# EAGLE schematic Schematic_v7 (EAGLE 9.7.0)
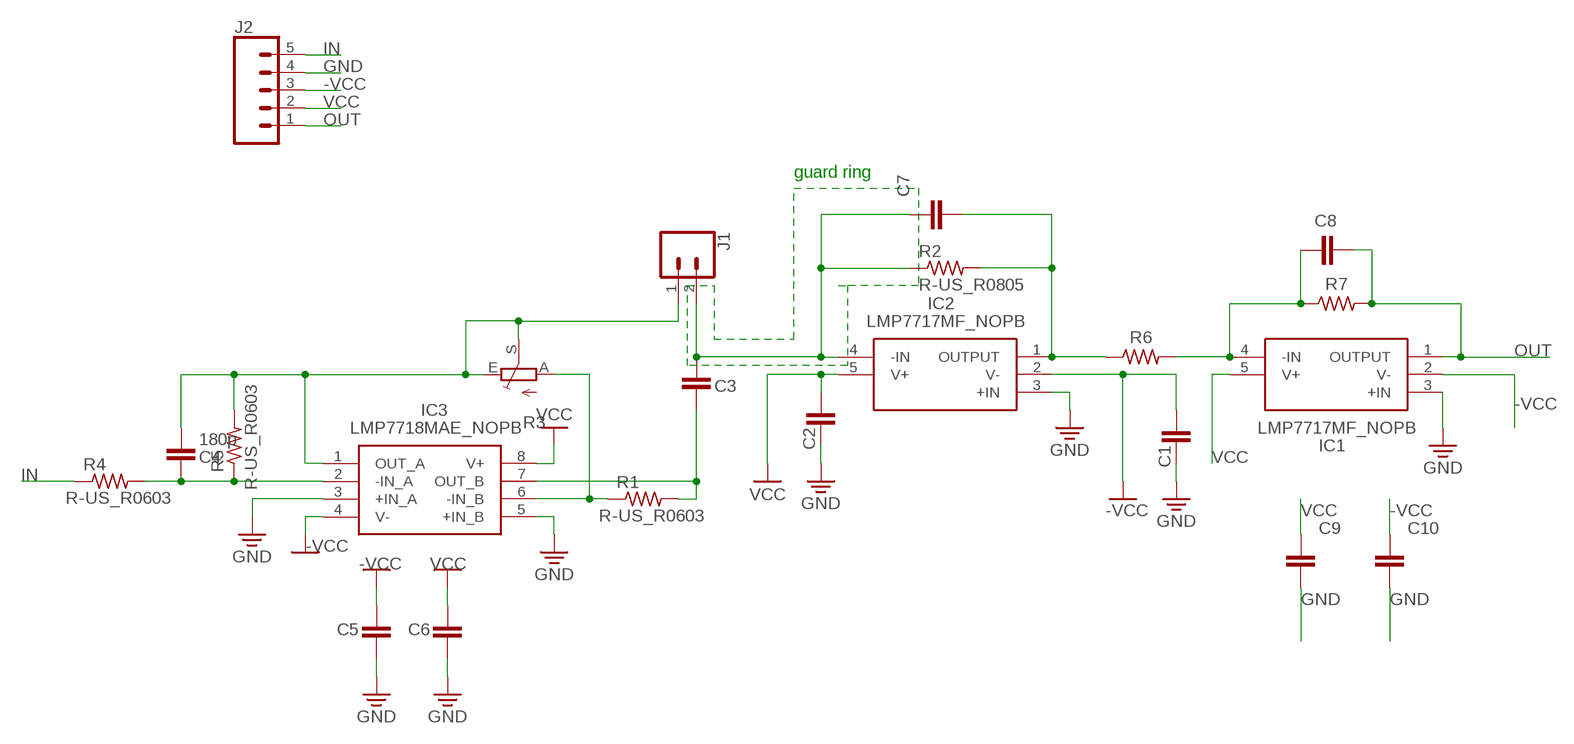
[diagram p0: schematic, sheet 1]

## Parts
C1  C_CHIP-0603(1608-METRIC)  [CAPC1608X85]
C2  C_CHIP-0603(1608-METRIC)  [CAPC1608X85]
C3  C_CHIP-0805(2012-METRIC)  [CAPC2012X110]
C4  180p  C_CHIP-0805(2012-METRIC)  [CAPC2012X110]
C5  C_CHIP-0805(2012-METRIC)  [CAPC2012X110]
C6  C_CHIP-0805(2012-METRIC)  [CAPC2012X110]
C7  C_CHIP-0805(2012-METRIC)  [CAPC2012X110]
C8  C_CHIP-0805(2012-METRIC)  [CAPC2012X110]
C9  C_CHIP-0603(1608-METRIC)  [CAPC1608X85]
C10  C_CHIP-0603(1608-METRIC)  [CAPC1608X85]
IC1  LMP7717MF_NOPB  [SOT95P280X145-5N]
IC2  LMP7717MF_NOPB  [SOT95P280X145-5N]
IC3  LMP7718MAE_NOPB  [SOIC127P600X175-8N]
J1  CONN_02LOCK  [1X02_LOCK]
J2  CONN_05  [1X05]
R1  R-US_R0603  [R0603]
R2  R-US_R0805  [R0805]
R3  TRIM_EU-RJ9W  [RJ9W]
R4  R-US_R0603  [R0603]
R5  R-US_R0603  [R0603]
R6  R-US_CHIP-0603(1608-METRIC)  [RESC1608X60]
R7  R-US_CHIP-0603(1608-METRIC)  [RESC1608X60]

## Nets
-VCC: C1.2 C5.2 C10.1 IC1.2(V-) IC2.2(V-) IC3.4(V-) J2.3 ; supply symbol labelled VCC
GND [New Class]: C1.1 C2.1 C5.1 C6.1 C9.2 C10.2 IC1.3(+IN) IC2.3(+IN) IC3.3(+IN_A) IC3.5(+IN_B) J2.4
IN: J2.5 R4.1
N$1: C7.2 IC2.1(OUTPUT) R2.2 R6.1
N$2: C3.1 C7.1 IC2.4(-IN) J1.2 R2.1
N$3: C4.1 IC3.1(OUT_A) J1.1 R3.E R3.S R5.2
N$4: C3.2 IC3.7(OUT_B) R1.2
N$5: IC3.6(-IN_B) R1.1 R3.A
N$6: C4.2 IC3.2(-IN_A) R4.2 R5.1
N$7: C8.1 IC1.4(-IN) R6.2 R7.1
OUT: C8.2 IC1.1(OUTPUT) J2.1 R7.2
VCC: C2.2 C6.2 C9.1 IC1.5(V+) IC2.5(V+) IC3.8(V+) J2.2

## Notes on the sheet
- guard ring

## Library data of the parts
C1-C10 = Capacitor:C: Capacitor - Generic; CATEGORY: Capacitor
IC1 IC2 = SamacSys_Parts:LMP7717MF_NOPB: Single Channel, 88 MHz, Precision, Low Noise, 1.8V CMOS Input, Decompensated Amplifier Source: Datasheet <http://www.ti.com/lit/ds/symlink/lmp7717.pdf>; DESCRIPTION: Single Channel, 88 MHz, Precision, Low Noise, 1.8V CMOS Input, Decompensated Amplifier; HEIGHT: 1.45mm; MANUFACTURER_NAME: Texas Instruments; MANUFACTURER_PART_NUMBER: LMP7717MF/NOPB; MOUSER_PART_NUMBER: 926-LMP7717MF/NOPB; MOUSER_PRICE-STOCK: https://www.mouser.com/Search/Refine.aspx?Keyword=926-LMP7717MF%2FNOPB; RS_PART_NUMBER: 0408704P; RS_PRICE-STOCK: http://uk.rs-online.com/web/p/products/0408704P
IC3 = SamacSys_Parts:LMP7718MAE_NOPB: Operational Amplifiers - Op Amps 88 MHz, Precision, Low Noise, 1.8V CMOS Input, Decompensated Operational Amplifier 8-SOIC -40 to 125 Source: Datasheet <http://www.ti.com/lit/ds/symlink/lmp7718.pdf>; DESCRIPTION: Operational Amplifiers - Op Amps 88 MHz, Precision, Low Noise, 1.8V CMOS Input, Decompensated Operational Amplifier 8-SOIC -40 to 125; HEIGHT: 1.75mm; MANUFACTURER_NAME: Texas Instruments; MANUFACTURER_PART_NUMBER: LMP7718MAE/NOPB; MOUSER_PART_NUMBER: 926-LMP7718MAE/NOPB; MOUSER_PRICE-STOCK: https://www.mouser.com/Search/Refine.aspx?Keyword=926-LMP7718MAE%2FNOPB
J1 = SparkFun-Connectors:CONN_02: Multi connection point. Often used as Generic Header-pin footprint for 0.1 inch spaced/style header connections On any of the 0.1 inch spaced packages, you can populate with these: Break Away Headers - Straight <https://www.sparkfun.com/products/116> (PRT-00116) Break Away Male Headers - Right Angle <https://www.sparkfun.com/products/553> (PRT-00553) Female Headers <https://www.sparkfun.com/products/115> (PRT-00115) Break Away Headers - Machine Pin <https://www.sparkfun.com/products/117> (PRT-00117) Break Away Female Headers - Swiss Machine Pin <https://www.sparkfun.com/products/743> (PRT-00743) For SCREWTERMINALS and SPRING TERMINALS visit here: Screw Terimnals on SparkFun.com <https://www.sparkfun.com/search/results?term=Screw+Terminals> (5mm/3.5mm/2.54mm spacing) This device is also useful as a general connection point to wire up your design to another part of your project. Our various solder wires solder well into these plated through hole pads. Hook-Up Wire - Assortment (Stranded, 22 AWG) <https://www.sparkfun.com/products/11375> (PRT-11375) Hook-Up Wire - Assortment (Solid Core, 22 AWG) <https://www.sparkfun.com/products/11367> (PRT-11367) View the entire wire category on our website here <https://www.sparkfun.com/categories/141> Special notes: Molex polarized connector foot print use with: PRT-08233 with associated crimp pins and housings. 2.54_SCREWTERM for use with PRT-10571. 3.5mm Screw Terminal footprints for PRT-08084 5mm Screw Terminal footprints for use with PRT-08432
J2 = SparkFun-Connectors:CONN_05: Multi connection point. Often used as Generic Header-pin footprint for 0.1 inch spaced/style header connections On any of the 0.1 inch spaced packages, you can populate with these: Break Away Headers - Straight <https://www.sparkfun.com/products/116> (PRT-00116) Break Away Male Headers - Right Angle <https://www.sparkfun.com/products/553> (PRT-00553) Female Headers <https://www.sparkfun.com/products/115> (PRT-00115) Break Away Headers - Machine Pin <https://www.sparkfun.com/products/117> (PRT-00117) Break Away Female Headers - Swiss Machine Pin <https://www.sparkfun.com/products/743> (PRT-00743) For SCREWTERMINALS and SPRING TERMINALS visit here: Screw Terimnals on SparkFun.com <https://www.sparkfun.com/search/results?term=Screw+Terminals> (5mm/3.5mm/2.54mm spacing) This device is also useful as a general connection point to wire up your design to another part of your project. Our various solder wires solder well into these plated through hole pads. Hook-Up Wire - Assortment (Stranded, 22 AWG) <https://www.sparkfun.com/products/11375> (PRT-11375) Hook-Up Wire - Assortment (Solid Core, 22 AWG) <https://www.sparkfun.com/products/11367> (PRT-11367) View the entire wire category on our website here <https://www.sparkfun.com/categories/141> Special notes: Molex polarized connector foot print use with SKU : PRT-08231 with associated crimp pins and housings. 1MM SMD Version SKU: PRT-10208
R1 R2 R5 = audio amplifier example:R-US_: RESISTOR, American symbol
R3 = pot:TRIM_EU-: POTENTIOMETER
R4 = audio amplifier example:R-US_: RESISTOR, American symbol; VALUE_: 20K
R6 R7 = Resistor:R-US: Resistor Fixed - ANSI; CATEGORY: Resistor; SUB-CATEGORY: Fixed